# EAGLE schematic pan_tilt_lidar (EAGLE 7.6.0)
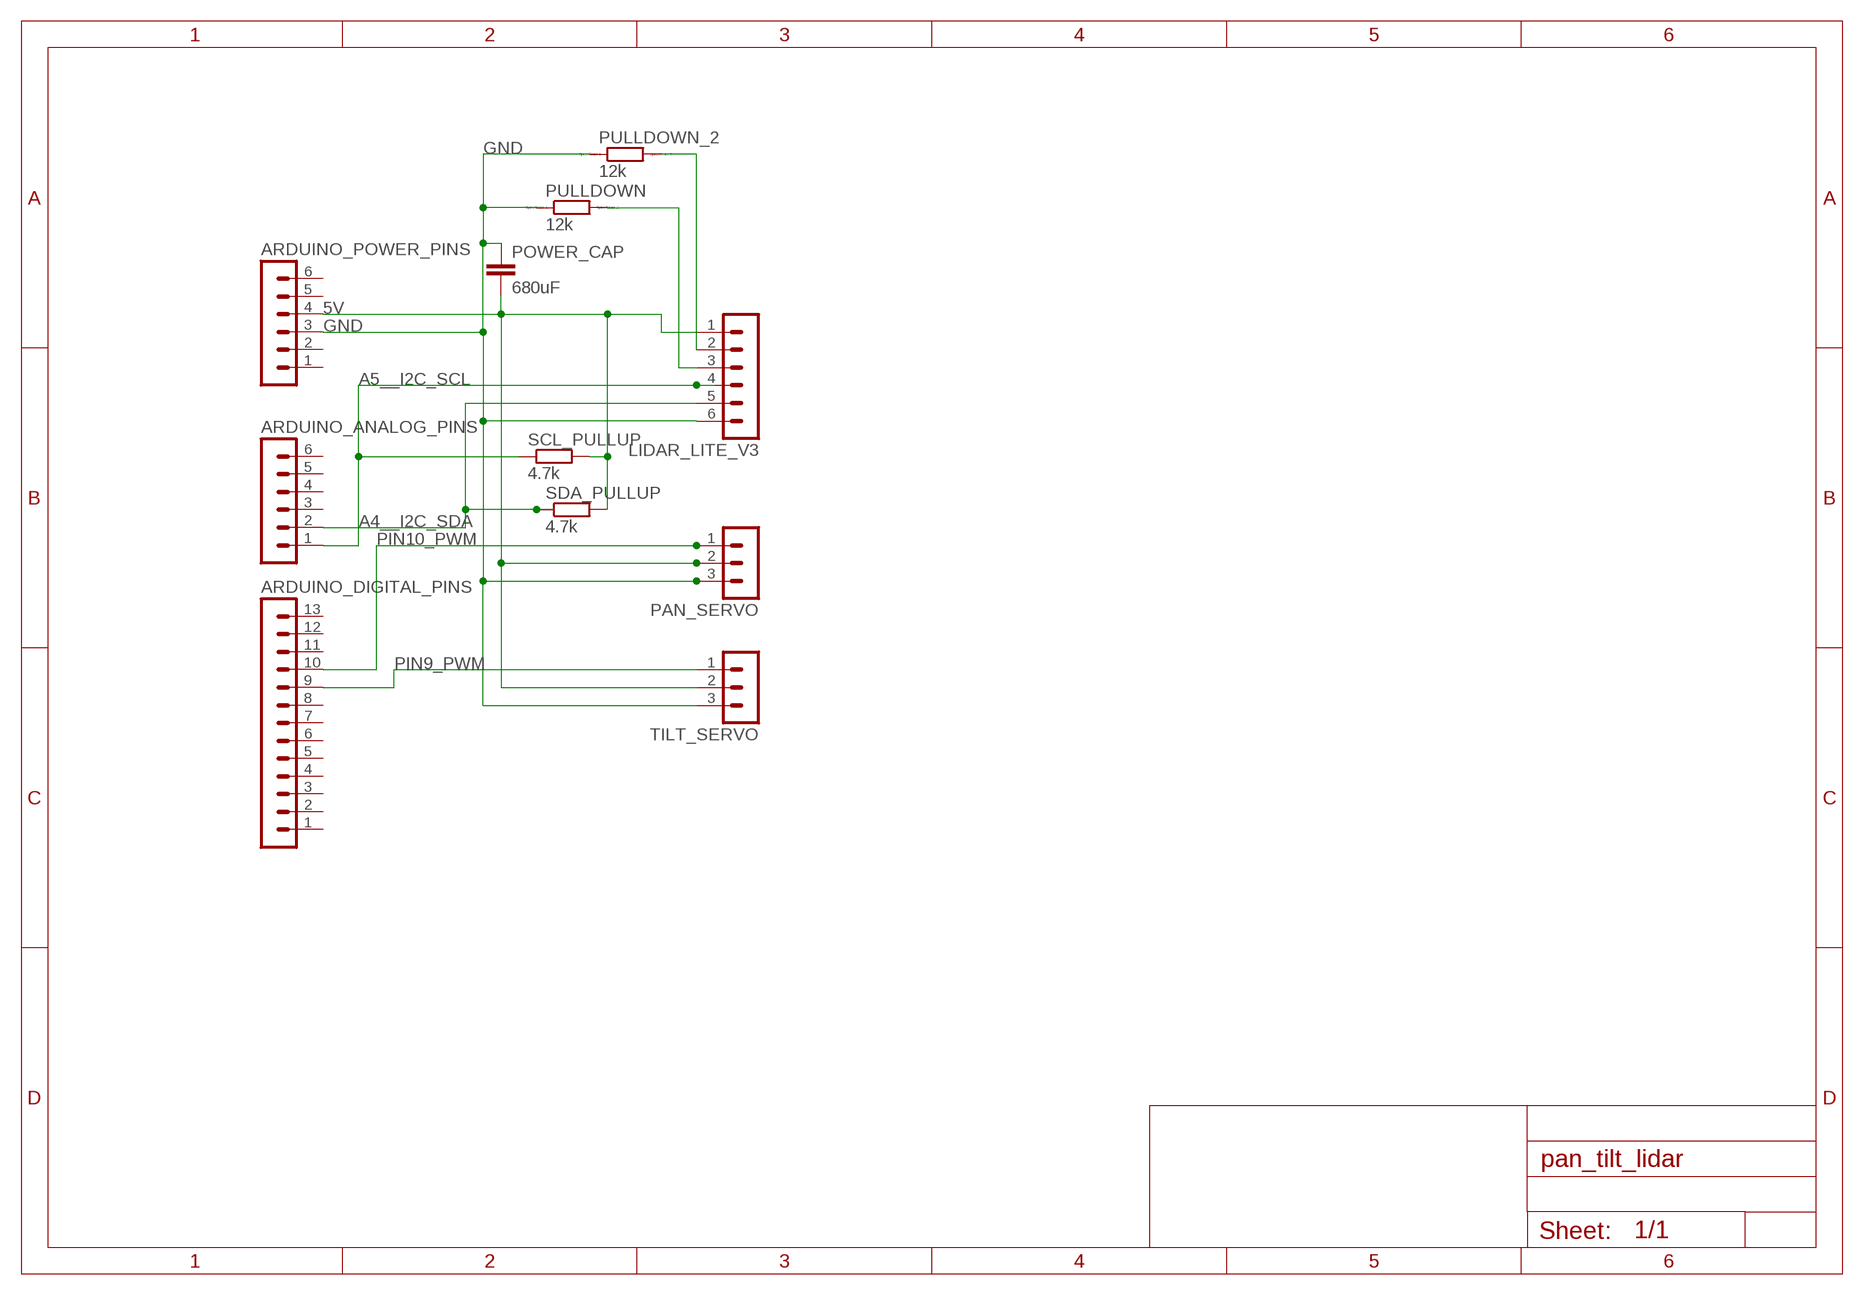
[diagram p0: schematic, sheet 1]

## Parts
ARDUINO_ANALOG_PINS  MA06-1  [MA06-1]
ARDUINO_DIGITAL_PINS  MA13-1W  [MA13-1W]
ARDUINO_POWER_PINS  MA06-1  [MA06-1]
LIDAR_LITE_V3  MA06-1  [MA06-1]
PAN_SERVO  MA03-1  [MA03-1]
POWER_CAP  680uF  C2.5/4  [C2.5-4]
PULLDOWN  12k  R0207/10  [0207/10]
PULLDOWN_2  12k  R0207/10  [0207/10]
SCL_PULLUP  4.7k  R-EU_0204/2V  [0204V]
SDA_PULLUP  4.7k  R-EU_0204/2V  [0204V]
TILT_SERVO  MA03-1  [MA03-1]

## Nets
5V: ARDUINO_POWER_PINS.4 LIDAR_LITE_V3.1 PAN_SERVO.2 POWER_CAP.2 SCL_PULLUP.2 SDA_PULLUP.2 TILT_SERVO.2
A4__I2C_SDA: ARDUINO_ANALOG_PINS.2 LIDAR_LITE_V3.5 SDA_PULLUP.1
A5__I2C_SCL: ARDUINO_ANALOG_PINS.1 LIDAR_LITE_V3.4 SCL_PULLUP.1
GND: ARDUINO_POWER_PINS.3 LIDAR_LITE_V3.6 PAN_SERVO.3 POWER_CAP.1 PULLDOWN.1 PULLDOWN_2.1 TILT_SERVO.3
N$1: LIDAR_LITE_V3.2 PULLDOWN_2.2
N$2: LIDAR_LITE_V3.3 PULLDOWN.2
PIN9_PWM: ARDUINO_DIGITAL_PINS.9 TILT_SERVO.1
PIN10_PWM: ARDUINO_DIGITAL_PINS.10 PAN_SERVO.1
Unconnected: ARDUINO_ANALOG_PINS.3 ARDUINO_ANALOG_PINS.4 ARDUINO_ANALOG_PINS.5 ARDUINO_ANALOG_PINS.6 ARDUINO_DIGITAL_PINS.1 ARDUINO_DIGITAL_PINS.2 ARDUINO_DIGITAL_PINS.3 ARDUINO_DIGITAL_PINS.4 ARDUINO_DIGITAL_PINS.5 ARDUINO_DIGITAL_PINS.6 ARDUINO_DIGITAL_PINS.7 ARDUINO_DIGITAL_PINS.8 ARDUINO_DIGITAL_PINS.11 ARDUINO_DIGITAL_PINS.12 ARDUINO_DIGITAL_PINS.13 ARDUINO_POWER_PINS.1 ARDUINO_POWER_PINS.2 ARDUINO_POWER_PINS.5 ARDUINO_POWER_PINS.6

## Library data of the parts
ARDUINO_ANALOG_PINS ARDUINO_POWER_PINS LIDAR_LITE_V3 = con-lstb:MA06-1: PIN HEADER; OC_FARNELL: unknown; OC_NEWARK: unknown
ARDUINO_DIGITAL_PINS = con-lstb:MA13-1W: PIN HEADER; OC_FARNELL: unknown; OC_NEWARK: unknown
PAN_SERVO TILT_SERVO = con-lstb:MA03-1: PIN HEADER; OC_FARNELL: unknown; OC_NEWARK: unknown
POWER_CAP = capacitor-wima:C: CAPACITOR naming: grid - package width
PULLDOWN PULLDOWN_2 = eagle-ltspice:R: RESISTOR, European symbol; SPICEMODEL: NONE; SPICEPREFIX: R
SCL_PULLUP SDA_PULLUP = rcl:R-EU_: RESISTOR, European symbol